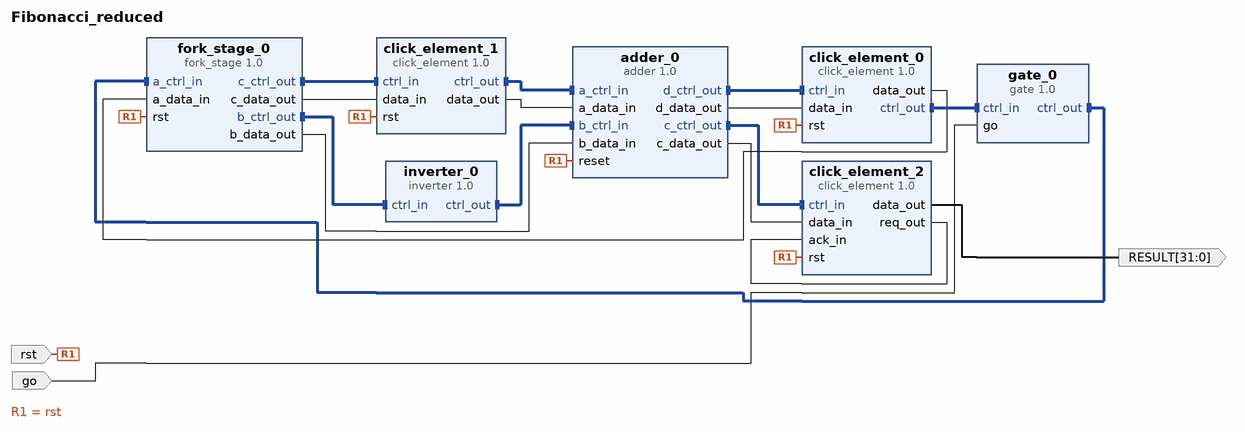
[diagram p0: block diagram of the top level]
# Vivado block design Fibonacci_reduced, xc7k70tfbv676-1, Vivado 2017.4
create_bd_design Fibonacci_reduced

create_bd_port -dir I go
create_bd_port -dir I rst
create_bd_port -dir O -from 31 -to 0 RESULT

create_bd_cell -type ip -vlnv xilinx.com:click_components:adder:1.0 adder_0
create_bd_cell -type ip -vlnv xilinx.com:click_components:click_element:1.0 click_element_0
set_property -dict {CONFIG.VALUE 1} [get_bd_cells click_element_0]
create_bd_cell -type ip -vlnv xilinx.com:click_components:click_element:1.0 click_element_1
set_property -dict {CONFIG.PHASE_INIT {"1"}} [get_bd_cells click_element_1]
create_bd_cell -type ip -vlnv xilinx.com:click_components:click_element:1.0 click_element_2
create_bd_cell -type ip -vlnv xilinx.com:click_components:fork_stage:1.0 fork_stage_0
set_property -dict {CONFIG.PHASE_INIT {"1"}} [get_bd_cells fork_stage_0]
create_bd_cell -type ip -vlnv xilinx.com:click_components:inverter:1.0 inverter_0
create_bd_cell -type ip -vlnv xilinx.com:click_components:gate:1.0 gate_0

# ---- connections ----

connect_bd_intf_net [get_bd_intf_pins adder_0/c_ctrl_out] [get_bd_intf_pins click_element_2/ctrl_in]
connect_bd_intf_net [get_bd_intf_pins click_element_0/ctrl_out] [get_bd_intf_pins gate_0/ctrl_in]
connect_bd_intf_net [get_bd_intf_pins gate_0/ctrl_out] [get_bd_intf_pins fork_stage_0/a_ctrl_in]
connect_bd_intf_net [get_bd_intf_pins fork_stage_0/b_ctrl_out] [get_bd_intf_pins inverter_0/ctrl_in]
connect_bd_intf_net [get_bd_intf_pins fork_stage_0/c_ctrl_out] [get_bd_intf_pins click_element_1/ctrl_in]
connect_bd_intf_net [get_bd_intf_pins click_element_1/ctrl_out] [get_bd_intf_pins adder_0/a_ctrl_in]
connect_bd_intf_net [get_bd_intf_pins inverter_0/ctrl_out] [get_bd_intf_pins adder_0/b_ctrl_in]
connect_bd_intf_net [get_bd_intf_pins adder_0/d_ctrl_out] [get_bd_intf_pins click_element_0/ctrl_in]
connect_bd_net [get_bd_pins click_element_0/data_out] [get_bd_pins fork_stage_0/a_data_in]
connect_bd_net [get_bd_pins fork_stage_0/b_data_out] [get_bd_pins adder_0/b_data_in]
connect_bd_net [get_bd_pins fork_stage_0/c_data_out] [get_bd_pins click_element_1/data_in]
connect_bd_net [get_bd_pins click_element_1/data_out] [get_bd_pins adder_0/a_data_in]
connect_bd_net [get_bd_pins adder_0/c_data_out] [get_bd_pins click_element_2/data_in]
connect_bd_net [get_bd_pins adder_0/d_data_out] [get_bd_pins click_element_0/data_in]
connect_bd_net [get_bd_ports go] [get_bd_pins gate_0/go]
connect_bd_net [get_bd_ports rst] \
  [get_bd_pins click_element_1/rst] [get_bd_pins adder_0/reset] [get_bd_pins click_element_2/rst] \
  [get_bd_pins fork_stage_0/rst] [get_bd_pins click_element_0/rst]
connect_bd_net [get_bd_pins click_element_2/req_out] [get_bd_pins click_element_2/ack_in]
connect_bd_net [get_bd_pins click_element_2/data_out] [get_bd_ports RESULT]

validate_bd_design
save_bd_design
